# Altium schematic sheet ad.SchDoc
size A4
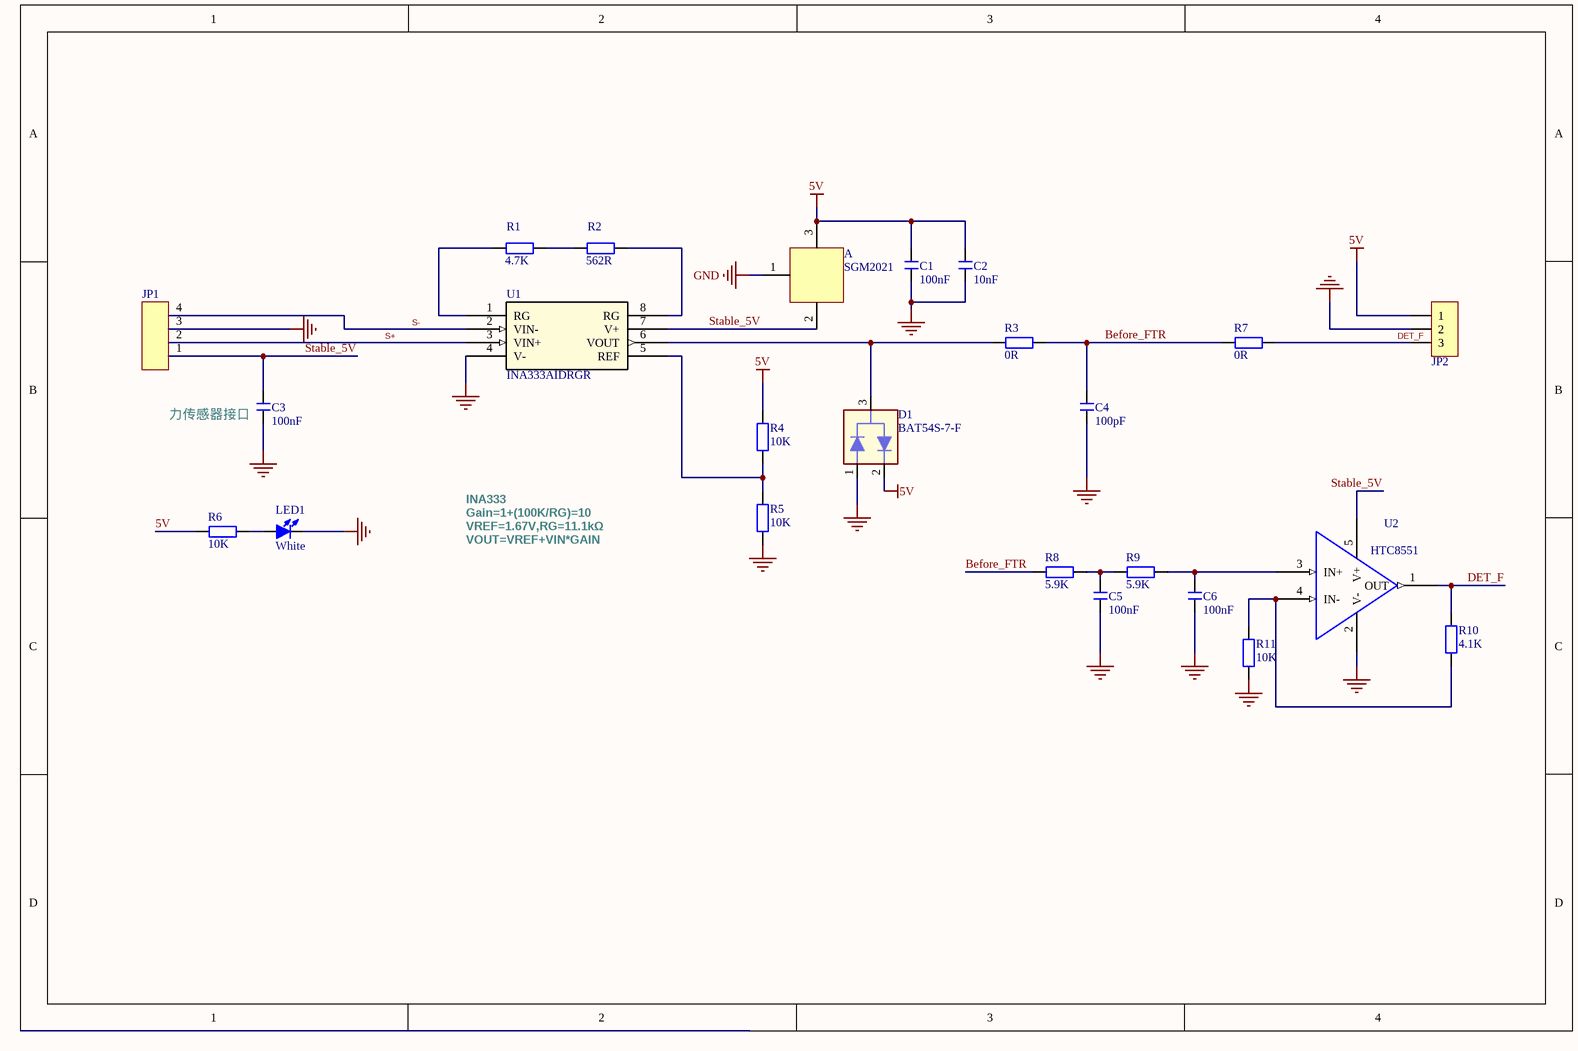
[diagram p0: ad.SchDoc]

## Parts
?  SGM2021  [V-Regulater-SGM2021]  (part A of 3)
C1  100nF  [C 0402_L]
C2  10nF  [C 0402_L]
C3  100nF  [C 0402_L]
C4  100pF  [C 0402_L]
C5  100nF  [C 0402_L]
C6  100nF  [C 0402_L]
D1  BAT54S-7-F  [D-Schott-BAT54S-7-F]
JP1  (no value)  [JP-4]
JP2  HDR-1X3  [Lines-3P]  (value not drawn)
LED1  White  [LED 0603W]
R1  4.7K  [R 0603_L]
R2  562R  [R 0603_L]
R3  0R  [R 0603_L]
R4  10K  [R 0402_L]
R5  10K  [R 0402_L]
R6  10K  [R 0402_L]
R7  0R  [R 0603_L]
R8  5.9K  [R 0402_L]
R9  5.9K  [R 0402_L]
R10  4.1K  [R 0402_L]
R11  10K  [R 0402_L]
U1  INA333AIDRGR  [DRG8_2P4X1P45]
U2  HTC8551  [HTC8551]

## Nets
5V: ?.3(IN) C1.2 C2.2 D1.2 JP2.1 R4.2 R6.2
GND: ?.1(GND) C1.1 C2.1 C3.1 C4.1 C5.1 C6.1 D1.1 JP1.3 JP2.2 LED1.2(K) R5.1 R11.2 U1.4(V-) U2.2(V-)
Before_FTR: C4.2 R3.2 R7.1 R8.2
DET_F: JP2.3 R7.2 R10.2 U2.1(OUT)
S+: JP1.2 U1.3(VIN+)
S-: JP1.4 U1.2(VIN-)
Stable_5V: ?.2(OUT) C3.2 JP1.1 U1.7(V+) U2.5(V+)
NetC5_2: C5.2 R8.1 R9.2
NetC6_2: C6.2 R9.1 U2.3(IN+)
NetD1_3: D1.3 R3.1 U1.6(VOUT)
NetLED1_1: LED1.1(A) R6.1
NetR1_1: R1.1 U1.1(RG)
NetR1_2: R1.2 R2.1
NetR2_2: R2.2 U1.8(RG)
NetR4_1: R4.1 R5.2 U1.5(REF)
NetR10_1: R10.1 R11.1 U2.4(IN-)

## Notes on the sheet
- 力传感器接口
- INA333
  Gain=1+(100K/RG)=10
  VREF=1.67V,RG=11.1kΩ
  VOUT=VREF+VIN*GAIN

## Library data of the parts
C1-C6 = C: 贴片电容; BOM名称: 无极性贴片电容; 封装库来自淘宝卖家 ID：黄晶宝石: 其他店铺购入均为盗版假冒封装库; 联系卖家，免费查找封装: 唯一出售店铺网址https://shop463601444.taobao.com
D1 = DIODE_SCHOTTKY_BAT54S
JP1 = JP-4
JP2 = Header 3: 3P接插件，SM03B-GHS-TB; BOM名称: 3P接插件; 卖家免费技术支持，联系售后: 唯一出售店铺网址https://shop463601444.taobao.com; 封装库来自淘宝卖家 ID：黄晶宝石: 其他店铺购入均为假冒，请申请退款，本店现金奖励; 优秀评价可免费更新封装库: 联系淘宝ID：黄晶宝石，获取更新版封装库
LED1 = LED-SMD: 贴片LED; 封装库来自淘宝卖家 ID：黄晶宝石: 其他店铺购入均为假冒，请立即申请退款，本店奖励2~5元现金; 卖家免费查找封装，联系售后: 唯一出售店铺网址https://shop463601444.taobao.com; BOM名称: 贴片LED
R1-R3 R7-R11 = R: 贴片电阻,20kohm,±1%,1/10W,0603,SMD; 封装库来自淘宝卖家 ID：黄晶宝石: 其他店铺购入均为盗版假冒封装库; 联系卖家，免费查找封装: 唯一出售店铺网址https://shop463601444.taobao.com; BOM名称: 贴片电阻
R4-R6 = R: 贴片电阻; 封装库来自淘宝卖家 ID：黄晶宝石: 其他店铺购入均为盗版假冒封装库; 联系卖家，免费查找封装: 唯一出售店铺网址https://shop463601444.taobao.com; BOM名称: 贴片电阻
U1 = INA333AIDRGR: Low Power, Precision Instrumentation Amplifier; Manufacturer: Texas Instruments; GENERIC_PART_NUMBER: INA333; INDUSTRY_STD_PKG_TYPE: SON; FAMILY_NAME: SINGLE SUPPLY; PIN_COUNT: 8; PACKAGE_DESIGNATOR: DRG; Datasheet_URL: http://www.ti.com/lit/gpn/INA333; Vendor: Texas Instruments; Manufacturer_Part_Number: INA333AIDRGR; Copyright: Copyright (C) 2021 Accelerated Designs. All rights reserved; RefDes: RefDes; Type: DEV